# Altium schematic sheet Sheet1.SchDoc
size A3
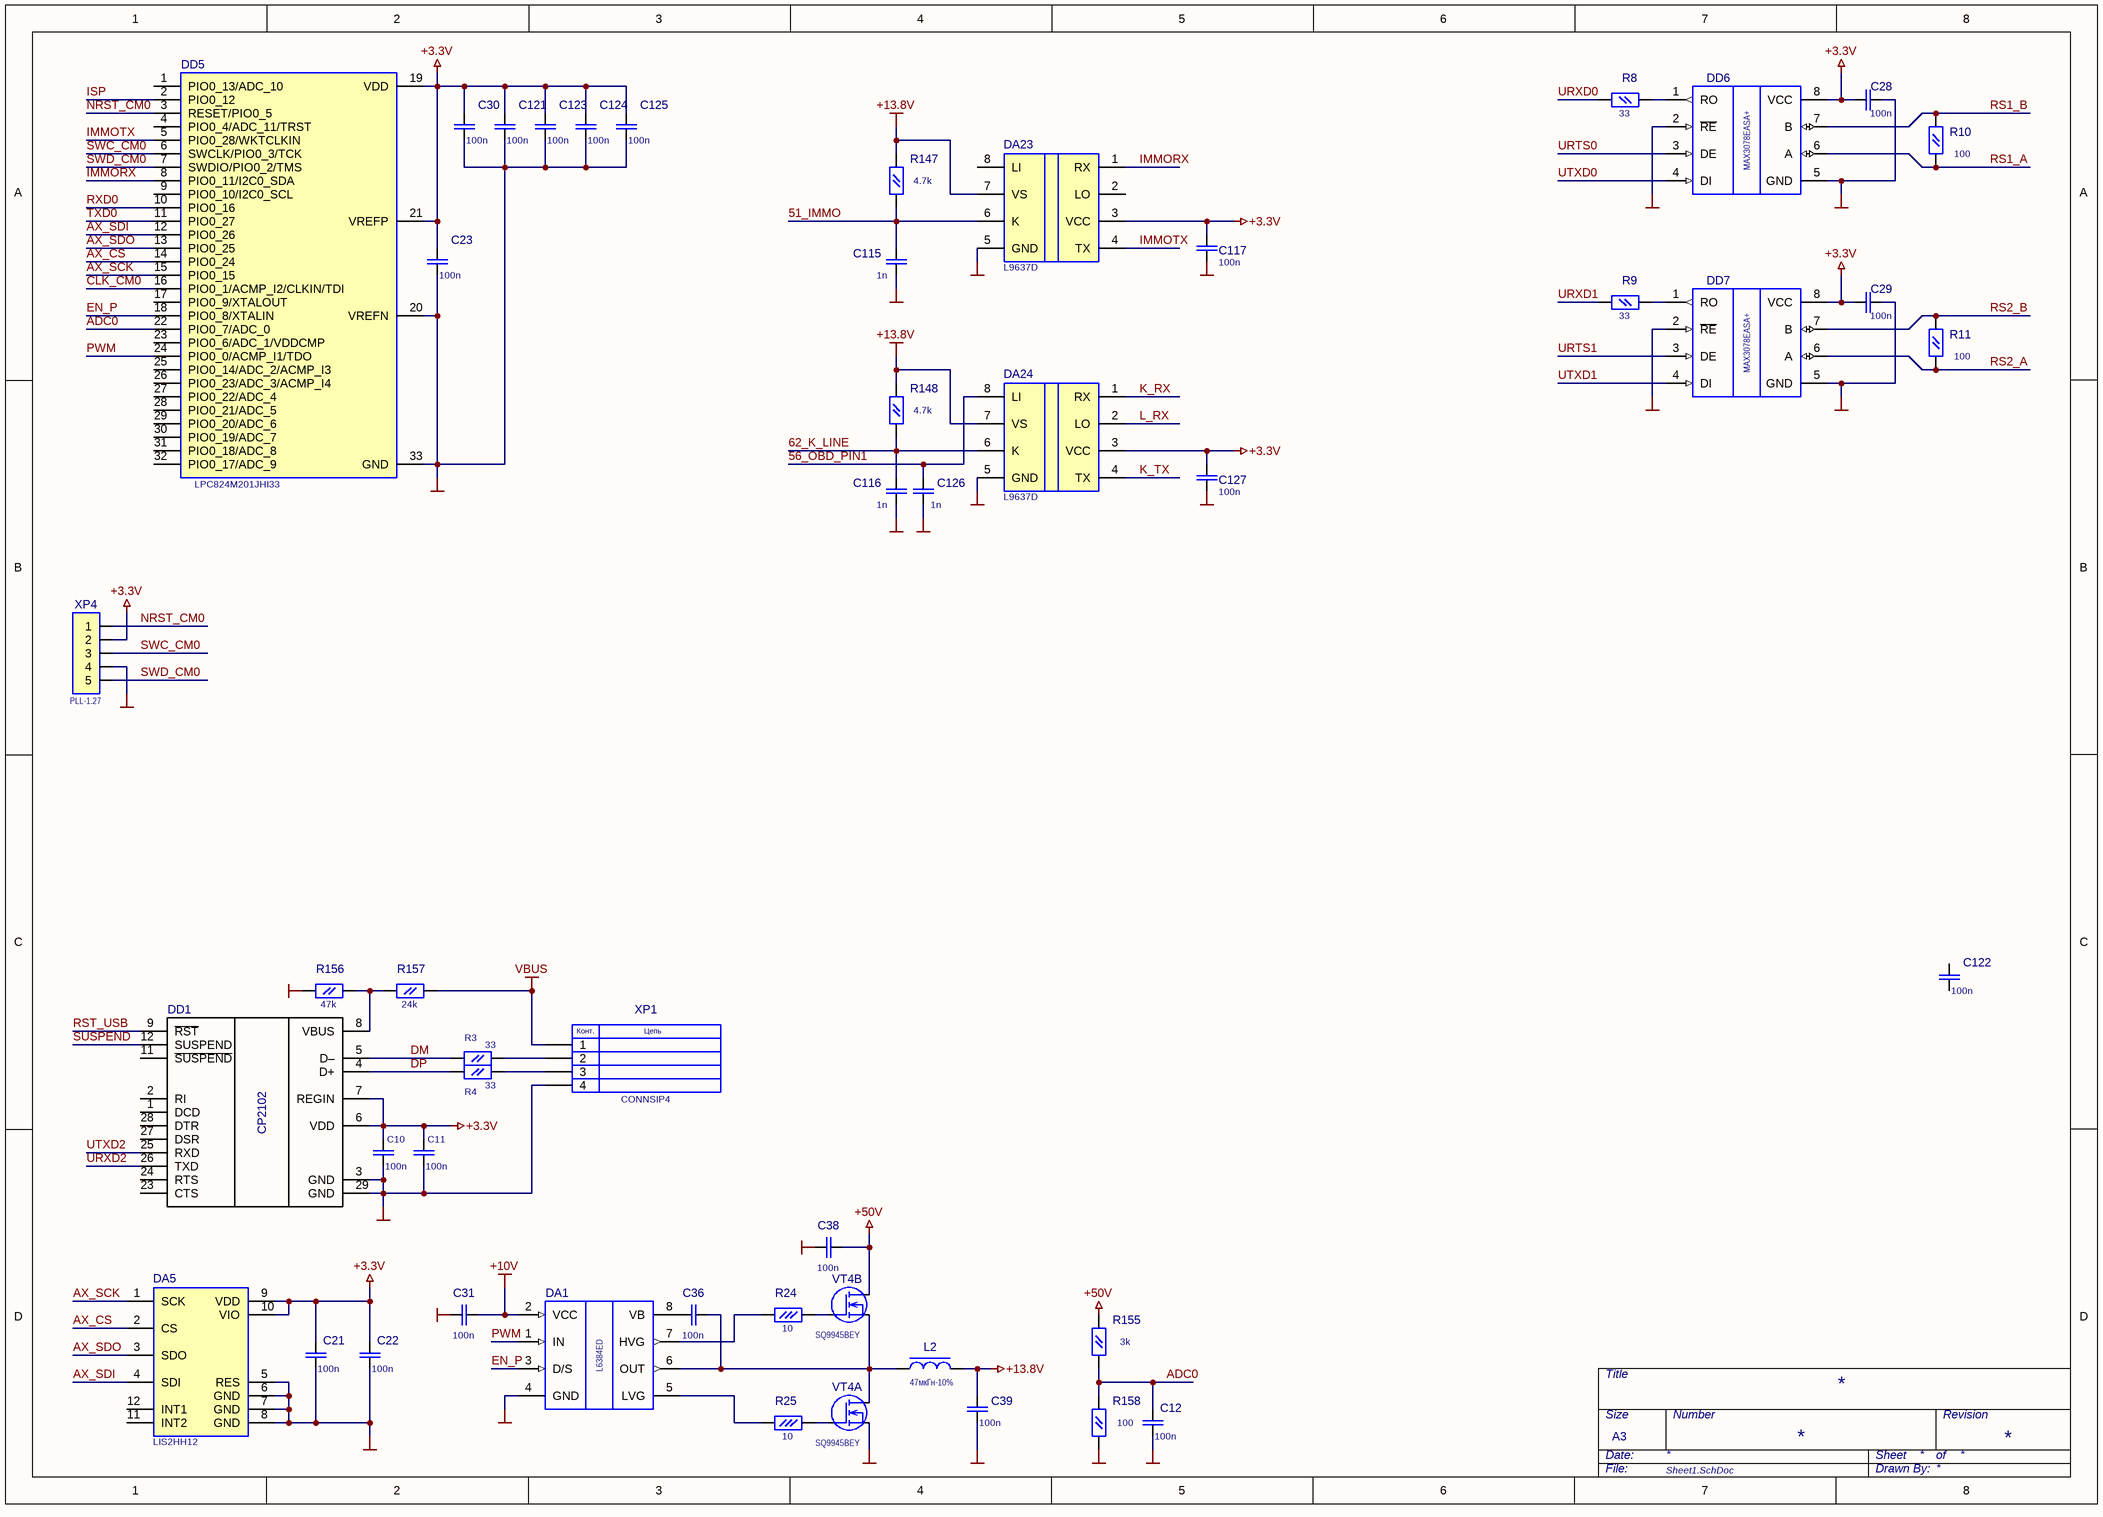
[diagram p0: Sheet1.SchDoc]

## Parts
C10  value 100n  [C0603L]  (hidden comment: CSMD)
C11  value 100n  [C0603L]  (hidden comment: CSMD)
C12  value 100n  [C0805L]  (hidden comment: 0.1мкФ-25В-X8R-10%)
C21  value 100n  [C0805L]  (hidden comment: 0.1мкФ-25В-X8R-10%)
C22  value 100n  [C0805L]  (hidden comment: 0.1мкФ-25В-X8R-10%)
C23  value 100n  [C0603L]  (hidden comment: 0.1мкФ-25В-X8R-10%)
C28  value 100n  [C0805]  (hidden comment: 0.1мкФ-50В-X8R-10%)
C29  value 100n  [C0805]  (hidden comment: 0.1мкФ-50В-X8R-10%)
C30  value 100n  [C0603L]  (hidden comment: 0.1мкФ-25В-X8R-10%)
C31  value 100n  [C0805L]  (hidden comment: CSMD)
C36  value 100n  [C0805L]  (hidden comment: CSMD)
C38  value 100n  [C0805L]  (hidden comment: CSMD)
C39  value 100n  [C0805L]  (hidden comment: 0.1мкФ-25В-X8R-10%)
C115  value 1n  [C0805L]  (hidden comment: CSMD)
C116  value 1n  [C0805L]  (hidden comment: CSMD)
C117  value 100n  [C0805L]  (hidden comment: 1мкФ-25В-X7R-10%)
C121  value 100n  [C0603L]  (hidden comment: 0.1мкФ-25В-X8R-10%)
C122  value 100n  [C0805L]  (hidden comment: 0.1мкФ-50В-X8R-10%)
C123  value 100n  [C0603L]  (hidden comment: 0.1мкФ-25В-X8R-10%)
C124  value 100n  [C0603L]  (hidden comment: 0.1мкФ-25В-X8R-10%)
C125  value 100n  [C0603L]  (hidden comment: 0.1мкФ-25В-X8R-10%)
C126  value 1n  [C0805L]  (hidden comment: CSMD)
C127  value 100n  [C0805L]  (hidden comment: 1мкФ-25В-X7R-10%)
DA1  L6384ED  [SOIC8 JEDEC]
DA5  LIS2HH12  [LGA-12]
DA23  L9637D  [SOIC8 JEDEC]
DA24  L9637D  [SOIC8 JEDEC]
DD1  CP2102  [QFN-28]
DD5  LPC824M201JHI33  [HVQFN33]
DD6  MAX3078EASA+  [SOIC8 JEDEC]
DD7  MAX3078EASA+  [SOIC8 JEDEC]
L2  47мкГн-10%  [L_SDR0604]
R3  value 33  [R0603L]  (hidden comment: RSMD)
R4  value 33  [R0603L]  (hidden comment: RSMD)
R8  value 33  [R0603L]  (hidden comment: 33-5%)
R9  value 33  [R0603L]  (hidden comment: 33-5%)
R10  value 100  [R0805L]  (hidden comment: 100-5%)
R11  value 100  [R0805L]  (hidden comment: 100-5%)
R24  value 10  [R0603L]  (hidden comment: 100-5%)
R25  value 10  [R0603L]  (hidden comment: 100-5%)
R147  value 4.7k  [R0805L]  (hidden comment: RSMD)
R148  value 4.7k  [R0805L]  (hidden comment: RSMD)
R155  value 3k  [R0805L]  (hidden comment: RSMD)
R156  value 47k  [R0805L]  (hidden comment: RSMD)
R157  value 24k  [R0805L]  (hidden comment: RSMD)
R158  value 100  [R0805L]  (hidden comment: RSMD)
VT4  SQ9945BEY  [SOIC8 DBL FET]  (parts A,B of 2)
XP1  CONNSIP4  [SIP4]
XP4  PLL-1.27  [MHDR1X5]

## Nets
+3.3V: C10.2 C11.2 C21.2 C22.2 C23.2 C28.1 C29.1 C30.2 C117.2 C121.2 C123.2 C124.2 C125.2 C127.2 DA5.9(VDD) DA5.10(VIO) DA23.3(VCC) DA24.3(VCC) DD1.6(VDD) DD1.7(REGIN) DD5.19(VDD) DD5.21(VREFP) DD6.8(VCC) DD7.8(VCC) XP4.2
+10V: C31.1 DA1.2(VCC)
+13.8V: C39.1 DA23.7(VS) DA24.7(VS) L2.1 R147.2(Pin2) R148.2(Pin2)
+50V: C38.1 R155.2(Pin2) VT4.5
GND: C10.1 C11.1 C12.1 C21.1 C22.1 C23.1 C28.2 C29.2 C30.1 C31.2 C38.2 C39.2 C115.2 C116.2 C117.1 C121.1 C123.1 C124.1 C125.1 C126.2 C127.1 DA1.4(GND) DA5.5(RES) DA5.6(GND) DA5.7(GND) DA5.8(GND) DA23.5(GND) DA24.5(GND) DD1.3(GND) DD1.29(GND) DD5.20(VREFN) DD5.33(GND) DD6.2(~{RE}) DD6.5(GND) DD7.2(~{RE}) DD7.5(GND) R156.1(Pin1) R158.1(Pin1) VT4.1 XP1.4 XP4.4
VBUS: R157.2(Pin2) XP1.1
51_IMMO: C115.1 DA23.6(K) R147.1(Pin1)
56_OBD_PIN1: C126.1 DA24.8(LI)
62_K_LINE: C116.1 DA24.6(K) R148.1(Pin1)
ADC0: C12.2 DD5.22(PIO0_7/ADC_0) R155.1(Pin1) R158.2(Pin2)
AX_CS: DA5.2(CS) DD5.14(PIO0_24)
AX_SCK: DA5.1(SCK) DD5.15(PIO0_15)
AX_SDI: DA5.4(SDI) DD5.12(PIO0_26)
AX_SDO: DA5.3(SDO) DD5.13(PIO0_25)
CLK_CM0: DD5.16(PIO0_1/ACMP_I2/CLKIN/TDI)
DM: DD1.5(D–) R3.1(Pin1)
DP: DD1.4(D+) R4.1(Pin1)
EN_P: DA1.3(D/S) DD5.18(PIO0_8/XTALIN)
IMMORX: DA23.1(RX) DD5.8(PIO0_11/I2C0_SDA)
IMMOTX: DA23.4(TX) DD5.5(PIO0_28/WKTCLKIN)
ISP: DD5.2(PIO0_12)
K_RX: DA24.1(RX)
K_TX: DA24.4(TX)
L_RX: DA24.2(LO)
NRST_CM0: DD5.3(RESET/PIO0_5) XP4.1
PWM: DA1.1(IN) DD5.24(PIO0_0/ACMP_I1/TDO)
RS1_A: DD6.6(A) R10.1(Pin1)
RS1_B: DD6.7(B) R10.2(Pin2)
RS2_A: DD7.6(A) R11.1(Pin1)
RS2_B: DD7.7(B) R11.2(Pin2)
RST_USB: DD1.9(~{RST})
RXD0: DD5.10(PIO0_16)
SUSPEND: DD1.12(SUSPEND)
SWC_CM0: DD5.6(SWCLK/PIO0_3/TCK) XP4.3
SWD_CM0: DD5.7(SWDIO/PIO0_2/TMS) XP4.5
TXD0: DD5.11(PIO0_27)
URTS0: DD6.3(DE)
URTS1: DD7.3(DE)
URXD0: R8.2(Pin2)
URXD1: R9.2(Pin2)
URXD2: DD1.26(TXD)
UTXD0: DD6.4(DI)
UTXD1: DD7.4(DI)
UTXD2: DD1.25(RXD)
NetC36_1: C36.1 DA1.6(OUT) L2.2 VT4.3 VT4.6
NetC36_2: C36.2 DA1.8(VB)
NetDA1_5: DA1.5(LVG) R25.2
NetDA1_7: DA1.7(HVG) R24.2
NetDD1_8: DD1.8(VBUS) R156.2(Pin2) R157.1(Pin1)
NetDD6_1: DD6.1(RO) R8.1(Pin1)
NetDD7_1: DD7.1(RO) R9.1(Pin1)
NetR3_2: R3.2(Pin2) XP1.2
NetR4_2: R4.2(Pin2) XP1.3
NetR24_1: R24.1 VT4.4
NetR25_1: R25.1 VT4.2

Not connected (* = marked no-connect by the designer): C122 1 2; DA5 11(INT2) 12(INT1); DA23 2(LO) 8(LI); DD1 1(DCD) 2(RI) 10(NC) 11(~{SUSPEND}) 13(NC) 14(NC) 15(NC) 16(NC) 17(NC) 18(NC) 19(NC) 20(NC) 21(NC) 22(NC) 23(CTS) 24(RTS) 27(DSR) 28(DTR); DD5 1(PIO0_13/ADC_10) 4(PIO0_4/ADC_11/TRST) 9(PIO0_10/I2C0_SCL) 17(PIO0_9/XTALOUT) 23(PIO0_6/ADC_1/VDDCMP) 25(PIO0_14/ADC_2/ACMP_I3) 26(PIO0_23/ADC_3/ACMP_I4) 27(PIO0_22/ADC_4) 28(PIO0_21/ADC_5) 29(PIO0_20/ADC_6) 30(PIO0_19/ADC_7) 31(PIO0_18/ADC_8) 32(PIO0_17/ADC_9)

## Notes on the sheet
- Title
- Date:
- Size
- A3
- Number
- Sheet
- of
- Revision
- File:
- Drawn By:
- (in symbol CONNSIP4) Конт.; Цепь

## Library data of the parts
C10 C11 C28 C29 C31 C36 C38 C39 C115 C116 C126 = CSMD: C0603; Voltage: *; Part Field 1: *; Part Field 2: *
C12 C21-C23 C30 C121 C123-C125 = CSMD: C0603; Part Field 1: CGA3E2X8R1E104K080AA; Voltage: *; Part Field 2: *
C117 C127 = CSMD: C0603; Part Field 1: 0805; Voltage: *
C122 = CSMD: C0603; Part Field 1: C2012X8R1H104K125AA; Voltage: *; Part Field 2: *
DA5 = Lis2hh12: ultra-low-power high-performance 3-axis "pico" accelerometer; Part Field 1: *; Part Field 2: *
DA23 DA24 = L9637: Monolithic bus driver with ISO 9141 interface; Part Field 1: *; Part Field 2: *
DD6 DD7 = MAX3088ESA: MAX3078EASA+ или ISL3179EFBZ или ADM3078EYRZ; Value: *
L2 = DROSSEL3: Part Field 1: SDR0604- 470KL
R3 R4 R8-R11 R24 R25 R147 R148 R155-R158 = RSMD: R0805
  R3 R4 R8-R11 R24 R25 R156 R157: Part Field 1: *; Part Field 2: *
XP4 = CON5: Connector; Part Field 2: 5 конт.
XP1 = CONNSIP4: Value: *